# EAGLE schematic MC88110_SmokeTest (EAGLE 9.7.0)
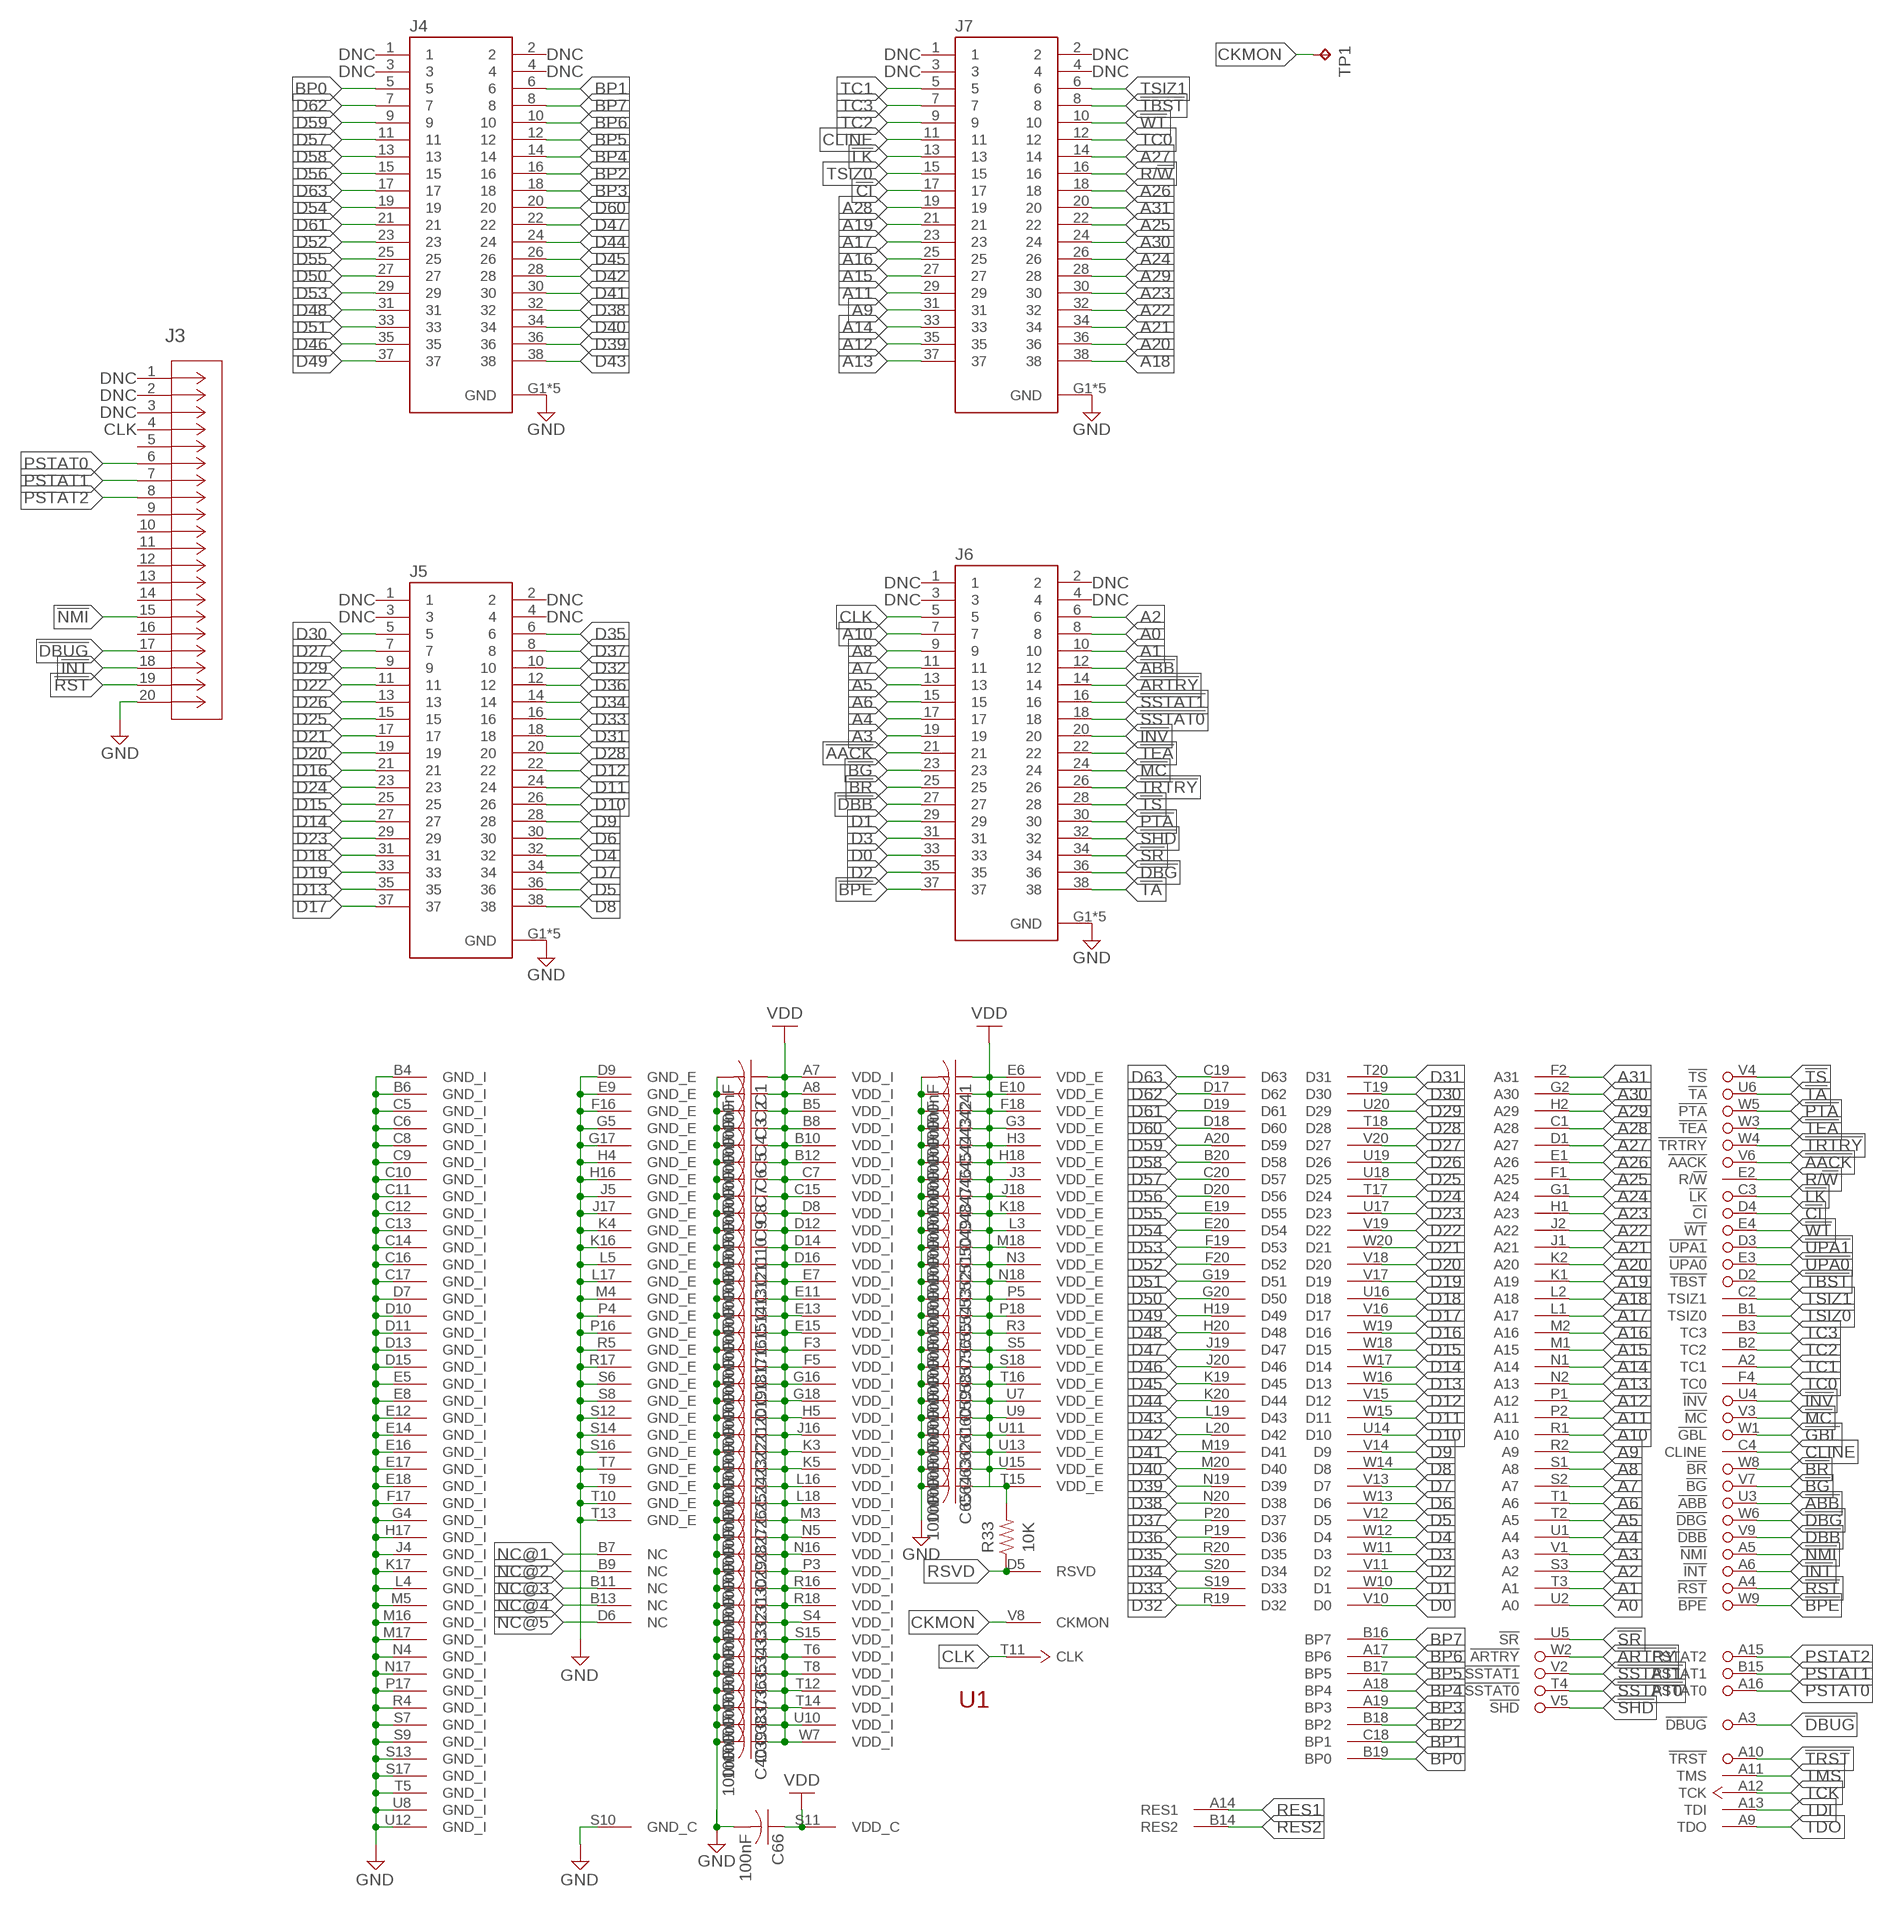
[diagram p0: schematic, sheet 1, part 1 of 2]
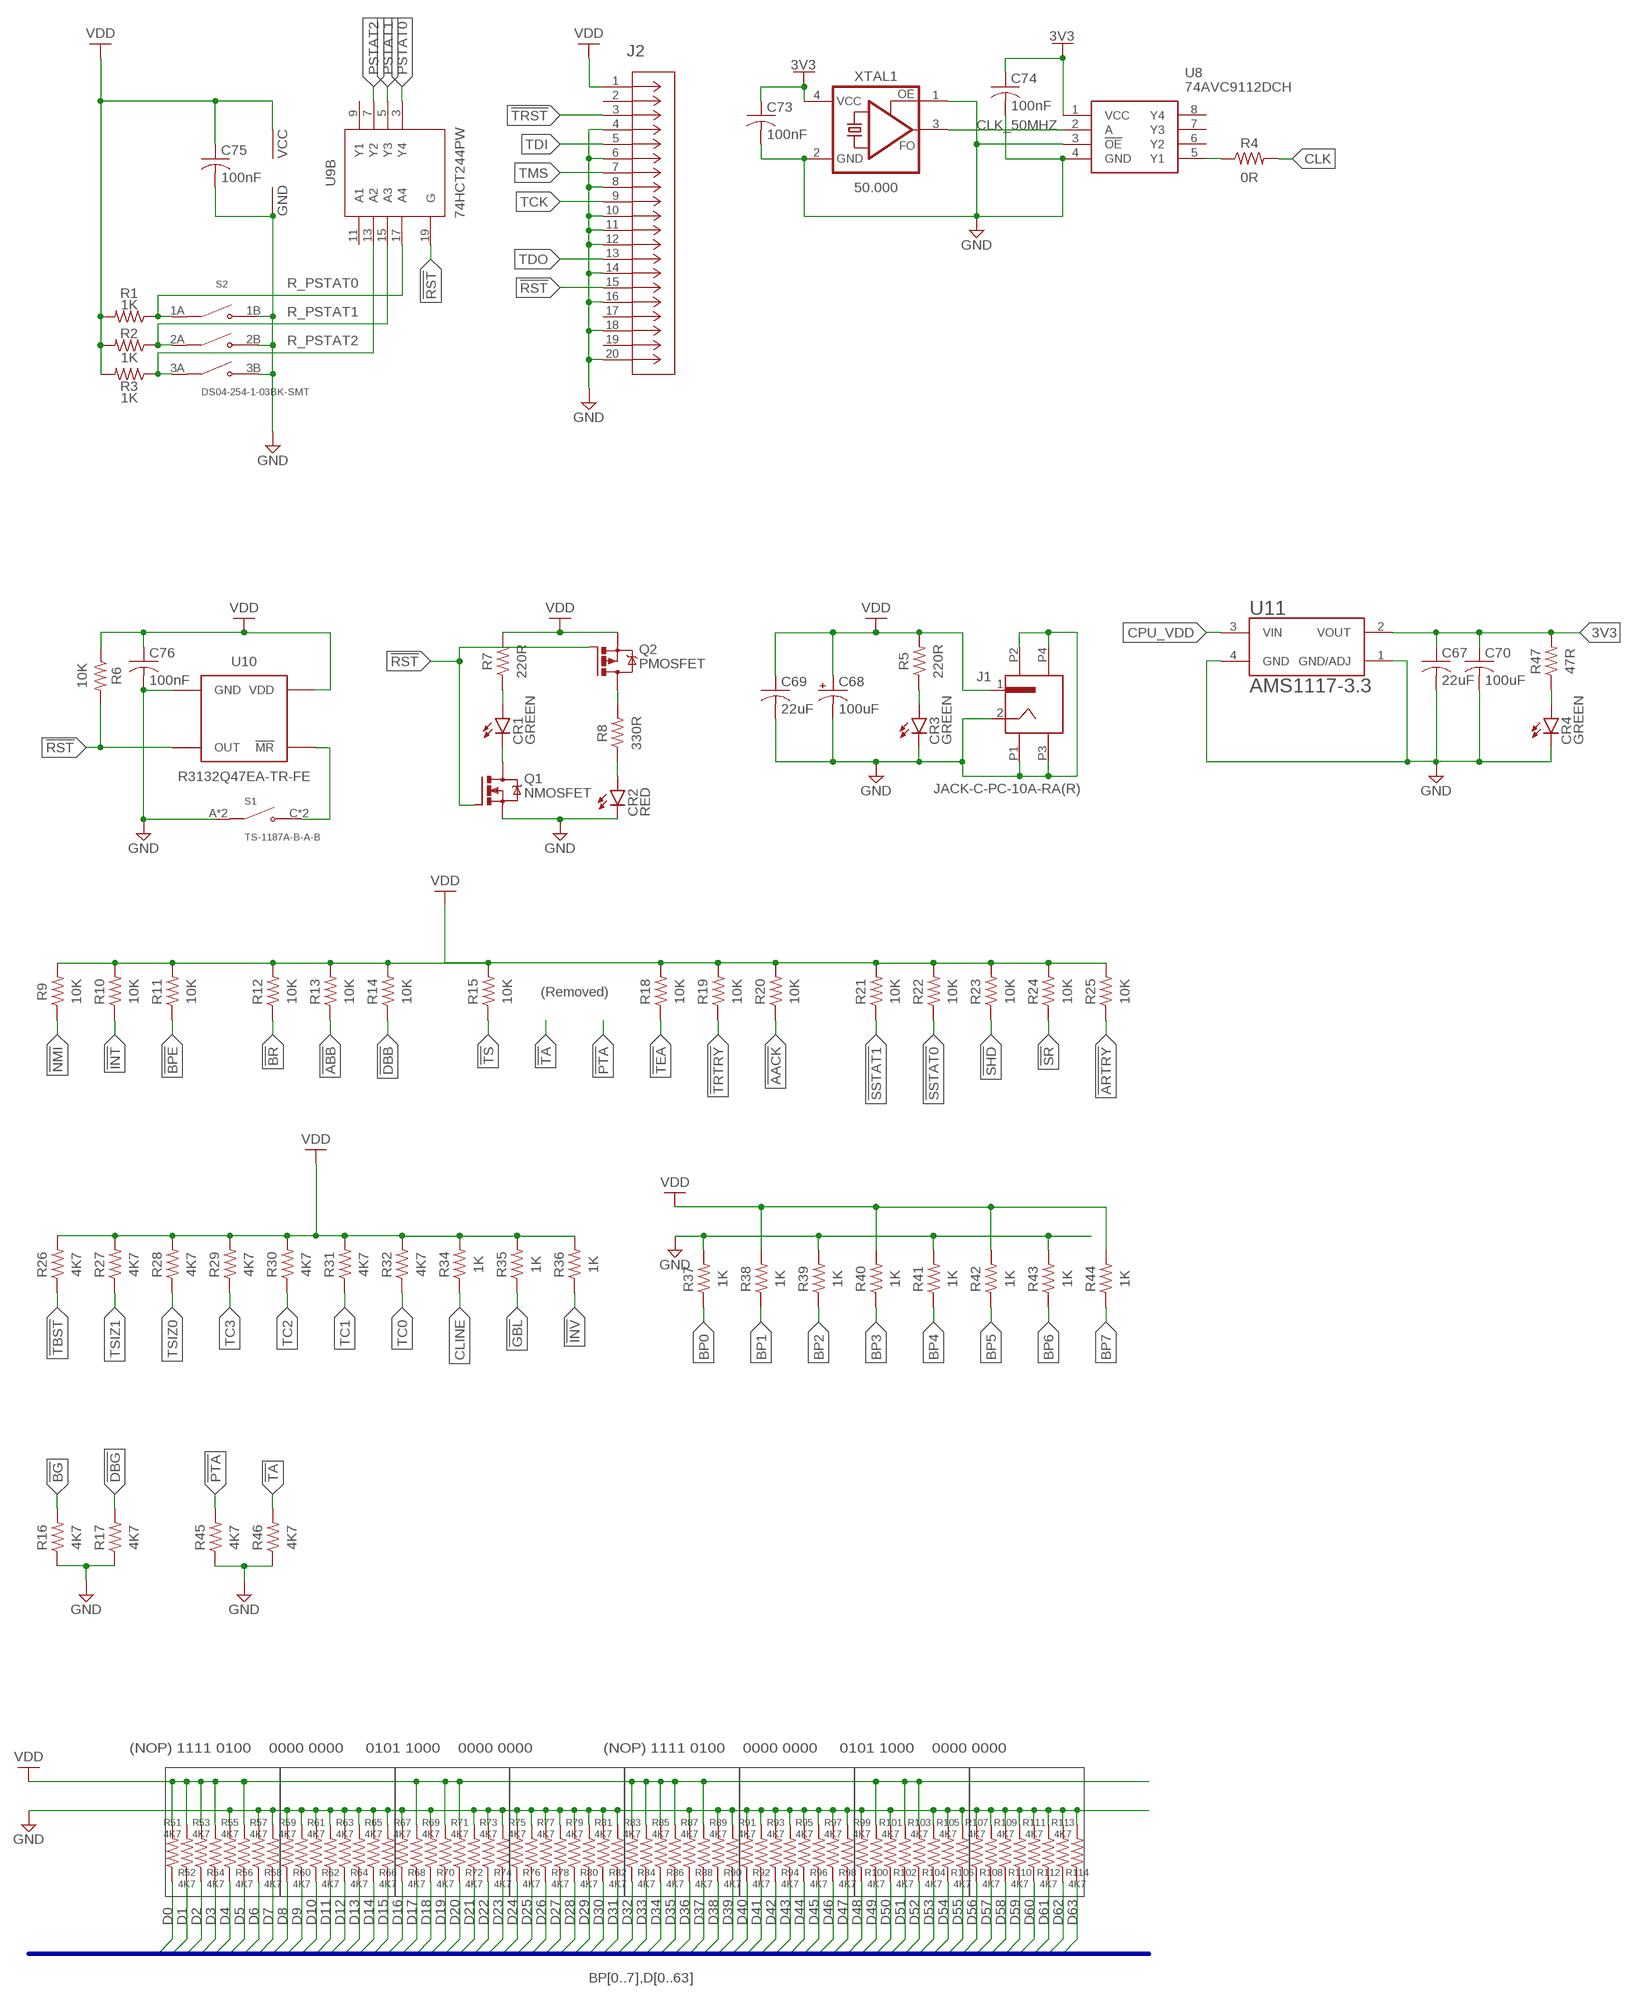
[diagram p1: schematic, sheet 1, part 2 of 2]

## Parts
C1  100nF  C-US_CHIP-0603(1608-METRIC)  [CAPC1608X85]
C2  100nF  C-US_CHIP-0603(1608-METRIC)  [CAPC1608X85]
C3  100nF  C-US_CHIP-0603(1608-METRIC)  [CAPC1608X85]
C4  100nF  C-US_CHIP-0603(1608-METRIC)  [CAPC1608X85]
C5  100nF  C-US_CHIP-0603(1608-METRIC)  [CAPC1608X85]
C6  100nF  C-US_CHIP-0603(1608-METRIC)  [CAPC1608X85]
C7  100nF  C-US_CHIP-0603(1608-METRIC)  [CAPC1608X85]
C8  100nF  C-US_CHIP-0603(1608-METRIC)  [CAPC1608X85]
C9  100nF  C-US_CHIP-0603(1608-METRIC)  [CAPC1608X85]
C10  100nF  C-US_CHIP-0603(1608-METRIC)  [CAPC1608X85]
C11  100nF  C-US_CHIP-0603(1608-METRIC)  [CAPC1608X85]
C12  100nF  C-US_CHIP-0603(1608-METRIC)  [CAPC1608X85]
C13  100nF  C-US_CHIP-0603(1608-METRIC)  [CAPC1608X85]
C14  100nF  C-US_CHIP-0603(1608-METRIC)  [CAPC1608X85]
C15  100nF  C-US_CHIP-0603(1608-METRIC)  [CAPC1608X85]
C16  100nF  C-US_CHIP-0603(1608-METRIC)  [CAPC1608X85]
C17  100nF  C-US_CHIP-0603(1608-METRIC)  [CAPC1608X85]
C18  100nF  C-US_CHIP-0603(1608-METRIC)  [CAPC1608X85]
C19  100nF  C-US_CHIP-0603(1608-METRIC)  [CAPC1608X85]
C20  100nF  C-US_CHIP-0603(1608-METRIC)  [CAPC1608X85]
C21  100nF  C-US_CHIP-0603(1608-METRIC)  [CAPC1608X85]
C22  100nF  C-US_CHIP-0603(1608-METRIC)  [CAPC1608X85]
C23  100nF  C-US_CHIP-0603(1608-METRIC)  [CAPC1608X85]
C24  100nF  C-US_CHIP-0603(1608-METRIC)  [CAPC1608X85]
C25  100nF  C-US_CHIP-0603(1608-METRIC)  [CAPC1608X85]
C26  100nF  C-US_CHIP-0603(1608-METRIC)  [CAPC1608X85]
C27  100nF  C-US_CHIP-0603(1608-METRIC)  [CAPC1608X85]
C28  100nF  C-US_CHIP-0603(1608-METRIC)  [CAPC1608X85]
C29  100nF  C-US_CHIP-0603(1608-METRIC)  [CAPC1608X85]
C30  100nF  C-US_CHIP-0603(1608-METRIC)  [CAPC1608X85]
C31  100nF  C-US_CHIP-0603(1608-METRIC)  [CAPC1608X85]
C32  100nF  C-US_CHIP-0603(1608-METRIC)  [CAPC1608X85]
C33  100nF  C-US_CHIP-0603(1608-METRIC)  [CAPC1608X85]
C34  100nF  C-US_CHIP-0603(1608-METRIC)  [CAPC1608X85]
C35  100nF  C-US_CHIP-0603(1608-METRIC)  [CAPC1608X85]
C36  100nF  C-US_CHIP-0603(1608-METRIC)  [CAPC1608X85]
C37  100nF  C-US_CHIP-0603(1608-METRIC)  [CAPC1608X85]
C38  100nF  C-US_CHIP-0603(1608-METRIC)  [CAPC1608X85]
C39  100nF  C-US_CHIP-0603(1608-METRIC)  [CAPC1608X85]
C40  100nF  C-US_CHIP-0603(1608-METRIC)  [CAPC1608X85]
C41  100nF  C-US_CHIP-0603(1608-METRIC)  [CAPC1608X85]
C42  100nF  C-US_CHIP-0603(1608-METRIC)  [CAPC1608X85]
C43  100nF  C-US_CHIP-0603(1608-METRIC)  [CAPC1608X85]
C44  100nF  C-US_CHIP-0603(1608-METRIC)  [CAPC1608X85]
C45  100nF  C-US_CHIP-0603(1608-METRIC)  [CAPC1608X85]
C46  100nF  C-US_CHIP-0603(1608-METRIC)  [CAPC1608X85]
C47  100nF  C-US_CHIP-0603(1608-METRIC)  [CAPC1608X85]
C48  100nF  C-US_CHIP-0603(1608-METRIC)  [CAPC1608X85]
C49  100nF  C-US_CHIP-0603(1608-METRIC)  [CAPC1608X85]
C50  100nF  C-US_CHIP-0603(1608-METRIC)  [CAPC1608X85]
C51  100nF  C-US_CHIP-0603(1608-METRIC)  [CAPC1608X85]
C52  100nF  C-US_CHIP-0603(1608-METRIC)  [CAPC1608X85]
C53  100nF  C-US_CHIP-0603(1608-METRIC)  [CAPC1608X85]
C54  100nF  C-US_CHIP-0603(1608-METRIC)  [CAPC1608X85]
C55  100nF  C-US_CHIP-0603(1608-METRIC)  [CAPC1608X85]
C56  100nF  C-US_CHIP-0603(1608-METRIC)  [CAPC1608X85]
C57  100nF  C-US_CHIP-0603(1608-METRIC)  [CAPC1608X85]
C58  100nF  C-US_CHIP-0603(1608-METRIC)  [CAPC1608X85]
C59  100nF  C-US_CHIP-0603(1608-METRIC)  [CAPC1608X85]
C60  100nF  C-US_CHIP-0603(1608-METRIC)  [CAPC1608X85]
C61  100nF  C-US_CHIP-0603(1608-METRIC)  [CAPC1608X85]
C62  100nF  C-US_CHIP-0603(1608-METRIC)  [CAPC1608X85]
C63  100nF  C-US_CHIP-0603(1608-METRIC)  [CAPC1608X85]
C64  100nF  C-US_CHIP-0603(1608-METRIC)  [CAPC1608X85]
C65  100nF  C-US_CHIP-0603(1608-METRIC)  [CAPC1608X85]
C66  100nF  C-US_CHIP-0603(1608-METRIC)  [CAPC1608X85]
C67  22uF  C-US_CHIP-0603(1608-METRIC)  [CAPC1608X85]
C68  100uF  C-POL-US_TANTALUM-2917(7343-METRIC)  [CAPMP7343X310N]
C69  22uF  C-US_CHIP-0603(1608-METRIC)  [CAPC1608X85]
C70  100uF  C-US_CHIP-0603(1608-METRIC)  [CAPC1608X85]
C73  100nF  C-US_CHIP-0603(1608-METRIC)  [CAPC1608X85]
C74  100nF  C-US_CHIP-0603(1608-METRIC)  [CAPC1608X85]
C75  100nF  C-US_CHIP-0603(1608-METRIC)  [CAPC1608X85]
C76  100nF  C-US_CHIP-0603(1608-METRIC)  [CAPC1608X85]
CR1  GREEN  LEDSML0603  [SML0603]
CR2  RED  LEDSML0603  [SML0603]
CR3  GREEN  LEDSML0603  [SML0603]
CR4  GREEN  LEDSML0603  [SML0603]
J1  JACK-C-PC-10A-RA(R)  [GLOBTECK_JACK-C-PC-10A-RA(R)]
J2  30320-6002HBCONN_30320-6002HB_3MM  [CONN_30320-6002HB_3MM]
J3  30320-6002HBCONN_30320-6002HB_3MM  [CONN_30320-6002HB_3MM]
J4  2-767004-2  [TE_2-767004-2]
J5  2-767004-2  [TE_2-767004-2]
J6  2-767004-2  [TE_2-767004-2]
J7  2-767004-2  [TE_2-767004-2]
Q1  NMOSFET  NMOSFETSOT23-GSD  [SOT23]
Q2  PMOSFET  PMOSFET_SOT23-GSD  [SOT23]
R1  1K  R-US_CHIP-0603(1608-METRIC)  [RESC1608X60]
R2  1K  R-US_CHIP-0603(1608-METRIC)  [RESC1608X60]
R3  1K  R-US_CHIP-0603(1608-METRIC)  [RESC1608X60]
R4  0R  R-US_CHIP-0603(1608-METRIC)  [RESC1608X60]
R5  220R  R-US_CHIP-0603(1608-METRIC)  [RESC1608X60]
R6  10K  R-US_CHIP-0603(1608-METRIC)  [RESC1608X60]
R7  220R  R-US_CHIP-0603(1608-METRIC)  [RESC1608X60]
R8  330R  R-US_CHIP-0603(1608-METRIC)  [RESC1608X60]
R9  10K  R-US_CHIP-0603(1608-METRIC)  [RESC1608X60]
R10  10K  R-US_CHIP-0603(1608-METRIC)  [RESC1608X60]
R11  10K  R-US_CHIP-0603(1608-METRIC)  [RESC1608X60]
R12  10K  R-US_CHIP-0603(1608-METRIC)  [RESC1608X60]
R13  10K  R-US_CHIP-0603(1608-METRIC)  [RESC1608X60]
R14  10K  R-US_CHIP-0603(1608-METRIC)  [RESC1608X60]
R15  10K  R-US_CHIP-0603(1608-METRIC)  [RESC1608X60]
R16  4K7  R-US_CHIP-0603(1608-METRIC)  [RESC1608X60]
R17  4K7  R-US_CHIP-0603(1608-METRIC)  [RESC1608X60]
R18  10K  R-US_CHIP-0603(1608-METRIC)  [RESC1608X60]
R19  10K  R-US_CHIP-0603(1608-METRIC)  [RESC1608X60]
R20  10K  R-US_CHIP-0603(1608-METRIC)  [RESC1608X60]
R21  10K  R-US_CHIP-0603(1608-METRIC)  [RESC1608X60]
R22  10K  R-US_CHIP-0603(1608-METRIC)  [RESC1608X60]
R23  10K  R-US_CHIP-0603(1608-METRIC)  [RESC1608X60]
R24  10K  R-US_CHIP-0603(1608-METRIC)  [RESC1608X60]
R25  10K  R-US_CHIP-0603(1608-METRIC)  [RESC1608X60]
R26  4K7  R-US_CHIP-0603(1608-METRIC)  [RESC1608X60]
R27  4K7  R-US_CHIP-0603(1608-METRIC)  [RESC1608X60]
R28  4K7  R-US_CHIP-0603(1608-METRIC)  [RESC1608X60]
R29  4K7  R-US_CHIP-0603(1608-METRIC)  [RESC1608X60]
R30  4K7  R-US_CHIP-0603(1608-METRIC)  [RESC1608X60]
R31  4K7  R-US_CHIP-0603(1608-METRIC)  [RESC1608X60]
R32  4K7  R-US_CHIP-0603(1608-METRIC)  [RESC1608X60]
R33  10K  R-US_CHIP-0603(1608-METRIC)  [RESC1608X60]
R34  1K  R-US_CHIP-0603(1608-METRIC)  [RESC1608X60]
R35  1K  R-US_CHIP-0603(1608-METRIC)  [RESC1608X60]
R36  1K  R-US_CHIP-0603(1608-METRIC)  [RESC1608X60]
R37  1K  R-US_CHIP-0603(1608-METRIC)  [RESC1608X60]
R38  1K  R-US_CHIP-0603(1608-METRIC)  [RESC1608X60]
R39  1K  R-US_CHIP-0603(1608-METRIC)  [RESC1608X60]
R40  1K  R-US_CHIP-0603(1608-METRIC)  [RESC1608X60]
R41  1K  R-US_CHIP-0603(1608-METRIC)  [RESC1608X60]
R42  1K  R-US_CHIP-0603(1608-METRIC)  [RESC1608X60]
R43  1K  R-US_CHIP-0603(1608-METRIC)  [RESC1608X60]
R44  1K  R-US_CHIP-0603(1608-METRIC)  [RESC1608X60]
R45  4K7  R-US_CHIP-0603(1608-METRIC)  [RESC1608X60]
R46  4K7  R-US_CHIP-0603(1608-METRIC)  [RESC1608X60]
R47  47R  R-US_CHIP-0603(1608-METRIC)  [RESC1608X60]
R51  4K7  R-US_CHIP-0603(1608-METRIC)  [RESC1608X60]
R52  4K7  R-US_CHIP-0603(1608-METRIC)  [RESC1608X60]
R53  4K7  R-US_CHIP-0603(1608-METRIC)  [RESC1608X60]
R54  4K7  R-US_CHIP-0603(1608-METRIC)  [RESC1608X60]
R55  4K7  R-US_CHIP-0603(1608-METRIC)  [RESC1608X60]
R56  4K7  R-US_CHIP-0603(1608-METRIC)  [RESC1608X60]
R57  4K7  R-US_CHIP-0603(1608-METRIC)  [RESC1608X60]
R58  4K7  R-US_CHIP-0603(1608-METRIC)  [RESC1608X60]
R59  4K7  R-US_CHIP-0603(1608-METRIC)  [RESC1608X60]
R60  4K7  R-US_CHIP-0603(1608-METRIC)  [RESC1608X60]
R61  4K7  R-US_CHIP-0603(1608-METRIC)  [RESC1608X60]
R62  4K7  R-US_CHIP-0603(1608-METRIC)  [RESC1608X60]
R63  4K7  R-US_CHIP-0603(1608-METRIC)  [RESC1608X60]
R64  4K7  R-US_CHIP-0603(1608-METRIC)  [RESC1608X60]
R65  4K7  R-US_CHIP-0603(1608-METRIC)  [RESC1608X60]
R66  4K7  R-US_CHIP-0603(1608-METRIC)  [RESC1608X60]
R67  4K7  R-US_CHIP-0603(1608-METRIC)  [RESC1608X60]
R68  4K7  R-US_CHIP-0603(1608-METRIC)  [RESC1608X60]
R69  4K7  R-US_CHIP-0603(1608-METRIC)  [RESC1608X60]
R70  4K7  R-US_CHIP-0603(1608-METRIC)  [RESC1608X60]
R71  4K7  R-US_CHIP-0603(1608-METRIC)  [RESC1608X60]
R72  4K7  R-US_CHIP-0603(1608-METRIC)  [RESC1608X60]
R73  4K7  R-US_CHIP-0603(1608-METRIC)  [RESC1608X60]
R74  4K7  R-US_CHIP-0603(1608-METRIC)  [RESC1608X60]
R75  4K7  R-US_CHIP-0603(1608-METRIC)  [RESC1608X60]
R76  4K7  R-US_CHIP-0603(1608-METRIC)  [RESC1608X60]
R77  4K7  R-US_CHIP-0603(1608-METRIC)  [RESC1608X60]
R78  4K7  R-US_CHIP-0603(1608-METRIC)  [RESC1608X60]
R79  4K7  R-US_CHIP-0603(1608-METRIC)  [RESC1608X60]
R80  4K7  R-US_CHIP-0603(1608-METRIC)  [RESC1608X60]
R81  4K7  R-US_CHIP-0603(1608-METRIC)  [RESC1608X60]
R82  4K7  R-US_CHIP-0603(1608-METRIC)  [RESC1608X60]
R83  4K7  R-US_CHIP-0603(1608-METRIC)  [RESC1608X60]
R84  4K7  R-US_CHIP-0603(1608-METRIC)  [RESC1608X60]
R85  4K7  R-US_CHIP-0603(1608-METRIC)  [RESC1608X60]
R86  4K7  R-US_CHIP-0603(1608-METRIC)  [RESC1608X60]
R87  4K7  R-US_CHIP-0603(1608-METRIC)  [RESC1608X60]
R88  4K7  R-US_CHIP-0603(1608-METRIC)  [RESC1608X60]
R89  4K7  R-US_CHIP-0603(1608-METRIC)  [RESC1608X60]
R90  4K7  R-US_CHIP-0603(1608-METRIC)  [RESC1608X60]
R91  4K7  R-US_CHIP-0603(1608-METRIC)  [RESC1608X60]
R92  4K7  R-US_CHIP-0603(1608-METRIC)  [RESC1608X60]
R93  4K7  R-US_CHIP-0603(1608-METRIC)  [RESC1608X60]
R94  4K7  R-US_CHIP-0603(1608-METRIC)  [RESC1608X60]
R95  4K7  R-US_CHIP-0603(1608-METRIC)  [RESC1608X60]
R96  4K7  R-US_CHIP-0603(1608-METRIC)  [RESC1608X60]
R97  4K7  R-US_CHIP-0603(1608-METRIC)  [RESC1608X60]
R98  4K7  R-US_CHIP-0603(1608-METRIC)  [RESC1608X60]
R99  4K7  R-US_CHIP-0603(1608-METRIC)  [RESC1608X60]
R100  4K7  R-US_CHIP-0603(1608-METRIC)  [RESC1608X60]
R101  4K7  R-US_CHIP-0603(1608-METRIC)  [RESC1608X60]
R102  4K7  R-US_CHIP-0603(1608-METRIC)  [RESC1608X60]
R103  4K7  R-US_CHIP-0603(1608-METRIC)  [RESC1608X60]
R104  4K7  R-US_CHIP-0603(1608-METRIC)  [RESC1608X60]
R105  4K7  R-US_CHIP-0603(1608-METRIC)  [RESC1608X60]
R106  4K7  R-US_CHIP-0603(1608-METRIC)  [RESC1608X60]
R107  4K7  R-US_CHIP-0603(1608-METRIC)  [RESC1608X60]
R108  4K7  R-US_CHIP-0603(1608-METRIC)  [RESC1608X60]
R109  4K7  R-US_CHIP-0603(1608-METRIC)  [RESC1608X60]
R110  4K7  R-US_CHIP-0603(1608-METRIC)  [RESC1608X60]
R111  4K7  R-US_CHIP-0603(1608-METRIC)  [RESC1608X60]
R112  4K7  R-US_CHIP-0603(1608-METRIC)  [RESC1608X60]
R113  4K7  R-US_CHIP-0603(1608-METRIC)  [RESC1608X60]
R114  4K7  R-US_CHIP-0603(1608-METRIC)  [RESC1608X60]
S1  TS-1187A-B-A-B  [SW_TS-1187A-B-A-B]
S2  DS04-254-1-03BK-SMT  [SW_DS04-254-1-03BK-SMT]
TP1  TPTP10R  [TP10R]
U1  MC88110RC50H  [PGA299]
U8  74AVC9112DCH  [SOP50P310X100-8N]
U9  74HCT244PW  74HCT244S  [PW20]
U10  R3132Q47EA-TR-FE  R3132Q  [R3132Q]
U11  AMS1117-3.3  [SOT229P700X180-4N]
XTAL1  50.000  OSC_3.2X2.5X0.9  [OSCCC320X250X90]

## Nets
3V3 [Supply]: C67.1 C70.1 C73.1 C74.1 R47.2 U8.1(VCC) U11.2(VOUT) XTAL1.4(VCC)
!AACK [Signal]: J6.21 R20.1 U1.V6(!AACK)
!ABB [Signal]: J6.12 R13.1 U1.U3(!ABB)
!ARTRY [Signal]: J6.14 R25.1 U1.W2(!ARTRY)
!BG [Signal]: J6.23 R16.2 U1.V7(!BG)
!BPE [Signal]: J6.37 R11.1 U1.W9(!BPE)
!BR [Signal]: J6.25 R12.1 U1.W8(!BR)
!CI [Signal]: J7.17 U1.D4(!CI)
!DBB [Signal]: J6.27 R14.1 U1.V9(!DBB)
!DBG [Signal]: J6.36 R17.2 U1.W6(!DBG)
!DBUG [Signal]: J3.17 U1.A3(!DBUG)
!GBL [Signal]: R35.1 U1.W1(!GBL)
!INT [Signal]: J3.18 R10.1 U1.A6(!INT)
!INV [Signal]: J6.20 R36.1 U1.U4(!INV)
!LK [Signal]: J7.13 U1.C3(!LK)
!MC [Signal]: J6.24 U1.V3(!MC)
!MR [Signal]: S1.C(NO) S1.D(NO) U10.P$3(!MR)
!NMI [Signal]: J3.15 R9.1 U1.A5(!NMI)
!PTA [Signal]: J6.30 R45.2 U1.W5(!PTA)
!RST [Signal]: J2.15 J3.19 Q1.1(G) Q2.1(G) R6.2 U1.A4(!RST) U9.19(B:G) U10.P$2(OUT)
!SHD [Signal]: J6.32 R23.1 U1.V5(!SHD)
!SR [Signal]: J6.34 R24.1 U1.U5(!SR)
!SSTAT0 [Signal]: J6.18 R22.1 U1.T4(!SSTAT0)
!SSTAT1 [Signal]: J6.16 R21.1 U1.V2(!SSTAT1)
!TA [Signal]: J6.38 R46.2 U1.U6(!TA)
!TBST [Signal]: J7.8 R26.1 U1.D2(!TBST)
!TEA [Signal]: J6.22 R18.1 U1.W3(!TEA)
!TRST [Signal]: J2.3 U1.A10(!TRST)
!TRTRY [Signal]: J6.26 R19.1 U1.W4(!TRTRY)
!TS [Signal]: J6.28 R15.1 U1.V4(!TS)
!UPA0 [Signal]: U1.E3(!UPA0)
!UPA1 [Signal]: U1.D3(!UPA1)
!WT [Signal]: J7.10 U1.E4(!WT)
A0 [Signal]: J6.8 U1.U2(A0)
A1 [Signal]: J6.10 U1.T3(A1)
A2 [Signal]: J6.6 U1.S3(A2)
A3 [Signal]: J6.19 U1.V1(A3)
A4 [Signal]: J6.17 U1.U1(A4)
A5 [Signal]: J6.13 U1.T2(A5)
A6 [Signal]: J6.15 U1.T1(A6)
A7 [Signal]: J6.11 U1.S2(A7)
A8 [Signal]: J6.9 U1.S1(A8)
A9 [Signal]: J7.31 U1.R2(A9)
A10 [Signal]: J6.7 U1.R1(A10)
A11 [Signal]: J7.29 U1.P2(A11)
A12 [Signal]: J7.35 U1.P1(A12)
A13 [Signal]: J7.37 U1.N2(A13)
A14 [Signal]: J7.33 U1.N1(A14)
A15 [Signal]: J7.27 U1.M1(A15)
A16 [Signal]: J7.25 U1.M2(A16)
A17 [Signal]: J7.23 U1.L1(A17)
A18 [Signal]: J7.38 U1.L2(A18)
A19 [Signal]: J7.21 U1.K1(A19)
A20 [Signal]: J7.36 U1.K2(A20)
A21 [Signal]: J7.34 U1.J1(A21)
A22 [Signal]: J7.32 U1.J2(A22)
A23 [Signal]: J7.30 U1.H1(A23)
A24 [Signal]: J7.26 U1.G1(A24)
A25 [Signal]: J7.22 U1.F1(A25)
A26 [Signal]: J7.18 U1.E1(A26)
A27 [Signal]: J7.14 U1.D1(A27)
A28 [Signal]: J7.19 U1.C1(A28)
A29 [Signal]: J7.28 U1.H2(A29)
A30 [Signal]: J7.24 U1.G2(A30)
A31 [Signal]: J7.20 U1.F2(A31)
BP0 [Signal]: J4.5 R37.1 U1.B19(BP0)
BP1 [Signal]: J4.6 R38.1 U1.C18(BP1)
BP2 [Signal]: J4.16 R39.1 U1.B18(BP2)
BP3 [Signal]: J4.18 R40.1 U1.A19(BP3)
BP4 [Signal]: J4.14 R41.1 U1.A18(BP4)
BP5 [Signal]: J4.12 R42.1 U1.B17(BP5)
BP6 [Signal]: J4.10 R43.1 U1.A17(BP6)
BP7 [Signal]: J4.8 R44.1 U1.B16(BP7)
CKMON [Signal]: TP1.TP U1.V8(CKMON)
CLINE [Signal]: J7.11 R34.1 U1.C4(CLINE)
CLK [Signal]: J6.5 R4.2 U1.T11(CLK)
CLK_50MHZ [Signal]: U8.2(A) XTAL1.3(FO)
CPU_VDD [Supply]: C1.1 C2.1 C3.1 C4.1 C5.1 C6.1 C7.1 C8.1 C9.1 C10.1 C11.1 C12.1 C13.1 C14.1 C15.1 C16.1 C17.1 C18.1 C19.1 C20.1 C21.1 C22.1 C23.1 C24.1 C25.1 C26.1 C27.1 C28.1 C29.1 C30.1 C31.1 C32.1 C33.1 C34.1 C35.1 C36.1 C37.1 C38.1 C39.1 C40.1 C41.1 C42.1 C43.1 C44.1 C45.1 C46.1 C47.1 C48.1 C49.1 C50.1 C51.1 C52.1 C53.1 C54.1 C55.1 C56.1 C57.1 C58.1 C59.1 C60.1 C61.1 C62.1 C63.1 C64.1 C65.1 C66.1 C68.1(+) C69.1 C75.1 C76.1 J1.1 J2.1 Q2.2(S) R1.2 R2.2 R3.2 R5.2 R6.1 R7.2 R9.2 R10.2 R11.2 R12.2 R13.2 R14.2 R15.2 R18.2 R19.2 R20.2 R21.2 R22.2 R23.2 R24.2 R25.2 R26.2 R27.2 R28.2 R29.2 R30.2 R31.2 R32.2 R33.2 R34.2 R35.2 R36.2 R38.2 R40.2 R42.2 R44.2 R51.2 R52.2 R53.2 R54.2 R56.2 R68.2 R70.2 R71.2 R83.2 R84.2 R85.2 R86.2 R88.2 R100.2 R102.2 R103.2 U1.A7(VDD_I) U1.A8(VDD_I) U1.B5(VDD_I) U1.B8(VDD_I) U1.B10(VDD_I) U1.B12(VDD_I) U1.C7(VDD_I) U1.C15(VDD_I) U1.D8(VDD_I) U1.D12(VDD_I) U1.D14(VDD_I) U1.D16(VDD_I) U1.E6(VDD_E) U1.E7(VDD_I) U1.E10(VDD_E) U1.E11(VDD_I) U1.E13(VDD_I) U1.E15(VDD_I) U1.F3(VDD_I) U1.F5(VDD_I) U1.F18(VDD_E) U1.G3(VDD_E) U1.G16(VDD_I) U1.G18(VDD_I) U1.H3(VDD_E) U1.H5(VDD_I) U1.H18(VDD_E) U1.J3(VDD_E) U1.J16(VDD_I) U1.J18(VDD_E) U1.K3(VDD_I) U1.K5(VDD_I) U1.K18(VDD_E) U1.L3(VDD_E) U1.L16(VDD_I) U1.L18(VDD_I) U1.M3(VDD_I) U1.M18(VDD_E) U1.N3(VDD_E) U1.N5(VDD_I) U1.N16(VDD_I) U1.N18(VDD_E) U1.P3(VDD_I) U1.P5(VDD_E) U1.P18(VDD_E) U1.R3(VDD_E) U1.R16(VDD_I) U1.R18(VDD_I) U1.S4(VDD_I) U1.S5(VDD_E) U1.S11(VDD_C) U1.S15(VDD_I) U1.S18(VDD_E) U1.T6(VDD_I) U1.T8(VDD_I) U1.T12(VDD_I) U1.T14(VDD_I) U1.T15(VDD_E) U1.T16(VDD_E) U1.U7(VDD_E) U1.U9(VDD_E) U1.U10(VDD_I) U1.U11(VDD_E) U1.U13(VDD_E) U1.U15(VDD_E) U1.W7(VDD_I) U9.20(VCC) U10.P$4(VDD) U11.3(VIN) ; supply symbol labelled VDD
D0 [Signal]: J6.33 R51.1 U1.V10(D0)
D1 [Signal]: J6.29 R52.1 U1.W10(D1)
D2 [Signal]: J6.35 R53.1 U1.V11(D2)
D3 [Signal]: J6.31 R54.1 U1.W11(D3)
D4 [Signal]: J5.32 R55.1 U1.W12(D4)
D5 [Signal]: J5.36 R56.1 U1.V12(D5)
D6 [Signal]: J5.30 R57.1 U1.W13(D6)
D7 [Signal]: J5.34 R58.1 U1.V13(D7)
D8 [Signal]: J5.38 R59.1 U1.W14(D8)
D9 [Signal]: J5.28 R60.1 U1.V14(D9)
D10 [Signal]: J5.26 R61.1 U1.U14(D10)
D11 [Signal]: J5.24 R62.1 U1.W15(D11)
D12 [Signal]: J5.22 R63.1 U1.V15(D12)
D13 [Signal]: J5.35 R64.1 U1.W16(D13)
D14 [Signal]: J5.27 R65.1 U1.W17(D14)
D15 [Signal]: J5.25 R66.1 U1.W18(D15)
D16 [Signal]: J5.21 R67.1 U1.W19(D16)
D17 [Signal]: J5.37 R68.1 U1.V16(D17)
D18 [Signal]: J5.31 R69.1 U1.U16(D18)
D19 [Signal]: J5.33 R70.1 U1.V17(D19)
D20 [Signal]: J5.19 R71.1 U1.V18(D20)
D21 [Signal]: J5.17 R72.1 U1.W20(D21)
D22 [Signal]: J5.11 R73.1 U1.V19(D22)
D23 [Signal]: J5.29 R74.1 U1.U17(D23)
D24 [Signal]: J5.23 R75.1 U1.T17(D24)
D25 [Signal]: J5.15 R76.1 U1.U18(D25)
D26 [Signal]: J5.13 R77.1 U1.U19(D26)
D27 [Signal]: J5.7 R78.1 U1.V20(D27)
D28 [Signal]: J5.20 R79.1 U1.T18(D28)
D29 [Signal]: J5.9 R80.1 U1.U20(D29)
D30 [Signal]: J5.5 R81.1 U1.T19(D30)
D31 [Signal]: J5.18 R82.1 U1.T20(D31)
D32 [Signal]: J5.10 R83.1 U1.R19(D32)
D33 [Signal]: J5.16 R84.1 U1.S19(D33)
D34 [Signal]: J5.14 R85.1 U1.S20(D34)
D35 [Signal]: J5.6 R86.1 U1.R20(D35)
D36 [Signal]: J5.12 R87.1 U1.P19(D36)
D37 [Signal]: J5.8 R88.1 U1.P20(D37)
D38 [Signal]: J4.32 R89.1 U1.N20(D38)
D39 [Signal]: J4.36 R90.1 U1.N19(D39)
D40 [Signal]: J4.34 R91.1 U1.M20(D40)
D41 [Signal]: J4.30 R92.1 U1.M19(D41)
D42 [Signal]: J4.28 R93.1 U1.L20(D42)
D43 [Signal]: J4.38 R94.1 U1.L19(D43)
D44 [Signal]: J4.24 R95.1 U1.K20(D44)
D45 [Signal]: J4.26 R96.1 U1.K19(D45)
D46 [Signal]: J4.35 R97.1 U1.J20(D46)
D47 [Signal]: J4.22 R98.1 U1.J19(D47)
D48 [Signal]: J4.31 R99.1 U1.H20(D48)
D49 [Signal]: J4.37 R100.1 U1.H19(D49)
D50 [Signal]: J4.27 R101.1 U1.G20(D50)
D51 [Signal]: J4.33 R102.1 U1.G19(D51)
D52 [Signal]: J4.23 R103.1 U1.F20(D52)
D53 [Signal]: J4.29 R104.1 U1.F19(D53)
D54 [Signal]: J4.19 R105.1 U1.E20(D54)
D55 [Signal]: J4.25 R106.1 U1.E19(D55)
D56 [Signal]: J4.15 R107.1 U1.D20(D56)
D57 [Signal]: J4.11 R108.1 U1.C20(D57)
D58 [Signal]: J4.13 R109.1 U1.B20(D58)
D59 [Signal]: J4.9 R110.1 U1.A20(D59)
D60 [Signal]: J4.20 R111.1 U1.D18(D60)
D61 [Signal]: J4.21 R112.1 U1.D19(D61)
D62 [Signal]: J4.7 R113.1 U1.D17(D62)
D63 [Signal]: J4.17 R114.1 U1.C19(D63)
GND [Supply]: C1.2 C2.2 C3.2 C4.2 C5.2 C6.2 C7.2 C8.2 C9.2 C10.2 C11.2 C12.2 C13.2 C14.2 C15.2 C16.2 C17.2 C18.2 C19.2 C20.2 C21.2 C22.2 C23.2 C24.2 C25.2 C26.2 C27.2 C28.2 C29.2 C30.2 C31.2 C32.2 C33.2 C34.2 C35.2 C36.2 C37.2 C38.2 C39.2 C40.2 C41.2 C42.2 C43.2 C44.2 C45.2 C46.2 C47.2 C48.2 C49.2 C50.2 C51.2 C52.2 C53.2 C54.2 C55.2 C56.2 C57.2 C58.2 C59.2 C60.2 C61.2 C62.2 C63.2 C64.2 C65.2 C66.2 C67.2 C68.2(-) C69.2 C70.2 C73.2 C74.2 C75.2 C76.2 CR2.C CR3.C CR4.C J1.2 J1.P1 J1.P2 J1.P3 J1.P4 J2.4 J2.6 J2.8 J2.10 J2.11 J2.12 J2.14 J2.16 J2.18 J2.20 J3.20 J4.G1(GND) J4.G2(GND) J4.G3(GND) J4.G4(GND) J4.G5(GND) J5.G1(GND) J5.G2(GND) J5.G3(GND) J5.G4(GND) J5.G5(GND) J6.G1(GND) J6.G2(GND) J6.G3(GND) J6.G4(GND) J6.G5(GND) J7.G1(GND) J7.G2(GND) J7.G3(GND) J7.G4(GND) J7.G5(GND) Q1.2(S) R16.1 R17.1 R37.2 R39.2 R41.2 R43.2 R45.1 R46.1 R55.2 R57.2 R58.2 R59.2 R60.2 R61.2 R62.2 R63.2 R64.2 R65.2 R66.2 R67.2 R69.2 R72.2 R73.2 R74.2 R75.2 R76.2 R77.2 R78.2 R79.2 R80.2 R81.2 R82.2 R87.2 R89.2 R90.2 R91.2 R92.2 R93.2 R94.2 R95.2 R96.2 R97.2 R98.2 R99.2 R101.2 R104.2 R105.2 R106.2 R107.2 R108.2 R109.2 R110.2 R111.2 R112.2 R113.2 R114.2 S1.A(COM) S1.B(COM) S2.1B(NO1) S2.2B(NO2) S2.3B(NO3) U1.B4(GND_I) U1.B6(GND_I) U1.C5(GND_I) U1.C6(GND_I) U1.C8(GND_I) U1.C9(GND_I) U1.C10(GND_I) U1.C11(GND_I) U1.C12(GND_I) U1.C13(GND_I) U1.C14(GND_I) U1.C16(GND_I) U1.C17(GND_I) U1.D7(GND_I) U1.D9(GND_E) U1.D10(GND_I) U1.D11(GND_I) U1.D13(GND_I) U1.D15(GND_I) U1.E5(GND_I) U1.E8(GND_I) U1.E9(GND_E) U1.E12(GND_I) U1.E14(GND_I) U1.E16(GND_I) U1.E17(GND_I) U1.E18(GND_I) U1.F16(GND_E) U1.F17(GND_I) U1.G4(GND_I) U1.G5(GND_E) U1.G17(GND_E) U1.H4(GND_E) U1.H16(GND_E) U1.H17(GND_I) U1.J4(GND_I) U1.J5(GND_E) U1.J17(GND_E) U1.K4(GND_E) U1.K16(GND_E) U1.K17(GND_I) U1.L4(GND_I) U1.L5(GND_E) U1.L17(GND_E) U1.M4(GND_E) U1.M5(GND_I) U1.M16(GND_I) U1.M17(GND_I) U1.N4(GND_I) U1.N17(GND_I) U1.P4(GND_E) U1.P16(GND_E) U1.P17(GND_I) U1.R4(GND_I) U1.R5(GND_E) U1.R17(GND_E) U1.S6(GND_E) U1.S7(GND_I) U1.S8(GND_E) U1.S9(GND_I) U1.S10(GND_C) U1.S12(GND_E) U1.S13(GND_I) U1.S14(GND_E) U1.S16(GND_E) U1.S17(GND_I) U1.T5(GND_I) U1.T7(GND_E) U1.T9(GND_E) U1.T10(GND_E) U1.T13(GND_E) U1.U8(GND_I) U1.U12(GND_I) U8.3(!OE) U8.4(GND) U9.10(GND) U10.P$1(GND) U11.1(GND/ADJ) U11.4(GND) XTAL1.1(OE) XTAL1.2(GND)
LED1+ [LED]: CR1.A R7.1
LED1+1 [LED]: CR3.A R5.1
LED1+2 [LED]: CR4.A R47.1
LED1- [LED]: CR1.C Q1.3(D)
LED2+ [LED]: CR2.A R8.1
LV_CLK_CPU_R [Signal]: R4.1 U8.5(Y1)
NC@1 [Signal]: U1.B7(NC)
NC@2 [Signal]: U1.B9(NC)
NC@3 [Signal]: U1.B11(NC)
NC@4 [Signal]: U1.B13(NC)
NC@5 [Signal]: U1.D6(NC)
PSTAT0 [Signal]: J3.6 U1.A16(PSTAT0) U9.3(B:Y4)
PSTAT1 [Signal]: J3.7 U1.B15(PSTAT1) U9.5(B:Y3)
PSTAT2 [Signal]: J3.8 U1.A15(PSTAT2) U9.7(B:Y2)
R11+ [LED]: Q2.3(D) R8.2
R/!W [Signal]: J7.16 U1.E2(R/!W)
R_PSTAT0 [Signal]: R1.1 S2.1A(COM1) U9.17(B:A4)
R_PSTAT1 [Signal]: R2.1 S2.2A(COM2) U9.15(B:A3)
R_PSTAT2 [Signal]: R3.1 S2.3A(COM3) U9.13(B:A2)
RES1 [Signal]: U1.A14(RES1)
RES2 [Signal]: U1.B14(RES2)
RSVD [Signal]: R33.1 U1.D5(RSVD)
TC0 [Signal]: J7.12 R32.1 U1.F4(TC0)
TC1 [Signal]: J7.5 R31.1 U1.A2(TC1)
TC2 [Signal]: J7.9 R30.1 U1.B2(TC2)
TC3 [Signal]: J7.7 R29.1 U1.B3(TC3)
TCK [Signal]: J2.9 U1.A12(TCK)
TDI [Signal]: J2.5 U1.A13(TDI)
TDO [Signal]: J2.13 U1.A9(TDO)
TMS [Signal]: J2.7 U1.A11(TMS)
TSIZ0 [Signal]: J7.15 R28.1 U1.B1(TSIZ0)
TSIZ1 [Signal]: J7.6 R27.1 U1.C2(TSIZ1)
Unconnected: J2.2 J2.17 J2.19 J3.1 J3.2 J3.3 J3.4 J3.5 J3.9 J3.10 J3.11 J3.12 J3.13 J3.14 J3.16 J4.1 J4.2 J4.3 J4.4 J5.1 J5.2 J5.3 J5.4 J6.1 J6.2 J6.3 J6.4 J7.1 J7.2 J7.3 J7.4 U8.6(Y2) U8.7(Y3) U8.8(Y4) U9.1(A:G) U9.2(A:A1) U9.4(A:A2) U9.6(A:A3) U9.8(A:A4) U9.9(B:Y1) U9.11(B:A1) U9.12(A:Y4) U9.14(A:Y3) U9.16(A:Y2) U9.18(A:Y1)

## Buses
BP[0..7],D[0..63]

## Notes on the sheet
- DNC | DNC | DNC | DNC
- DNC | DNC | DNC | DNC
- DNC
- DNC
- DNC
- CLK
- DNC | DNC
- DNC | DNC | DNC | DNC
- DNC | DNC
- (Removed)
- (NOP) 1111 0100    0000 0000     0101 1000    0000 0000 | (NOP) 1111 0100    0000 0000     0101 1000    0000 0000

## Library data of the parts
C1-C66 C73-C76 = Capacitor:C-US: Capacitor - ANSI; CATEGORY: Capacitor; LCSC_PART: C14663; PACKAGE_SIZE: 0603; PACKAGE_TYPE: SMD; SUBCATEGORY: Ceramic Capacitors; TYPE: MLCC
C67 C69 = Capacitor:C-US: Capacitor - ANSI; CATEGORY: Capacitor; LCSC_PART: C86295; PACKAGE_SIZE: 0603; PACKAGE_TYPE: SMD; SUBCATEGORY: Ceramic Capacitors; TYPE: MLCC
C68 = Capacitor:C-POL-US: Capacitor Polarised - ANSI; CATEGORY: Capacitor; LCSC_PART: C129696; PACKAGE_SIZE: 2917; PACKAGE_TYPE: SMD; SUBCATEGORY: Tantalum Capacitors; TYPE: Polymer Capacitors
C70 = Capacitor:C-US: Capacitor - ANSI; CATEGORY: Capacitor; LCSC_PART: C1955164; PACKAGE_SIZE: 0603; PACKAGE_TYPE: SMD; SUBCATEGORY: Ceramic Capacitors; TYPE: MLCC
CR1 CR3 CR4 = led:LED: LED OSRAM: - CHIPLED LG R971, LG N971, LY N971, LG Q971, LY Q971, LO R971, LY R971 LH N974, LH R974 LS Q976, LO Q976, LY Q976 LO Q996 - Hyper CHIPLED LW Q18S LB Q993, LB Q99A, LB R99A - SideLED LS A670, LO A670, LY A670, LG A670, LP A670 LB A673, LV A673, LT A673, LW A673 LH A674 LY A675 LS A676, LA A676, LO A676, LY A676, LW A676 LS A679, LY A679, LG A679 - Hyper Micro SIDELED® LS Y876, LA Y876, LO Y876, LY Y876 LT Y87S - SmartLED LW L88C, LW L88S LB L89C, LB L89S, LG L890 LS L89K, LO L89K, LY L89K LS L896, LA L896, LO L896, LY L896 - TOPLED LS T670, LO T670, LY T670, LG T670, LP T670 LSG T670, LSP T670, LSY T670, LOP T670, LYG T670 LG T671, LOG T671, LSG T671 LB T673, LV T673, LT T673, LW T673 LH T674 LS T676, LA T676, LO T676, LY T676, LB T676, LH T676, LSB T676, LW T676 LB T67C, LV T67C, LT T67C, LS T67K, LO T67K, LY T67K, LW E67C LS E67B, LA E67B, LO E67B, LY E67B, LB E67C, LV E67C, LT E67C LW T67C LS T679, LY T679, LG T679 LS T770, LO T770, LY T770, LG T770, LP T770 LB T773, LV T773, LT T773, LW T773 LH T774 LS E675, LA E675, LY E675, LS T675 LS T776, LA T776, LO T776, LY T776, LB T776 LHGB T686 LT T68C, LB T68C - Hyper Mini TOPLED® LB M676 - Mini TOPLED Santana® LG M470 LS M47K, LO M47K, LY M47K Source: http://www.osram.convergy.de LUXEON: - LUMILED® LXK2-PW12-R00, LXK2-PW12-S00, LXK2-PW14-U00, LXK2-PW14-V00 LXK2-PM12-R00, LXK2-PM12-S00, LXK2-PM14-U00 LXK2-PE12-Q00, LXK2-PE12-R00, LXK2-PE12-S00, LXK2-PE14-T00, LXK2-PE14-U00 LXK2-PB12-K00, LXK2-PB12-L00, LXK2-PB12-M00, LXK2-PB14-N00, LXK2-PB14-P00, LXK2-PB14-Q00 LXK2-PR12-L00, LXK2-PR12-M00, LXK2-PR14-Q00, LXK2-PR14-R00 LXK2-PD12-Q00, LXK2-PD12-R00, LXK2-PD12-S00 LXK2-PH12-R00, LXK2-PH12-S00 LXK2-PL12-P00, LXK2-PL12-Q00, LXK2-PL12-R00 Source: www.luxeon.com KINGBRIGHT: KA-3528ASYC Source: www.kingbright.com; LCSC_PART: C12624
CR2 = led:LED: LED OSRAM: - CHIPLED LG R971, LG N971, LY N971, LG Q971, LY Q971, LO R971, LY R971 LH N974, LH R974 LS Q976, LO Q976, LY Q976 LO Q996 - Hyper CHIPLED LW Q18S LB Q993, LB Q99A, LB R99A - SideLED LS A670, LO A670, LY A670, LG A670, LP A670 LB A673, LV A673, LT A673, LW A673 LH A674 LY A675 LS A676, LA A676, LO A676, LY A676, LW A676 LS A679, LY A679, LG A679 - Hyper Micro SIDELED® LS Y876, LA Y876, LO Y876, LY Y876 LT Y87S - SmartLED LW L88C, LW L88S LB L89C, LB L89S, LG L890 LS L89K, LO L89K, LY L89K LS L896, LA L896, LO L896, LY L896 - TOPLED LS T670, LO T670, LY T670, LG T670, LP T670 LSG T670, LSP T670, LSY T670, LOP T670, LYG T670 LG T671, LOG T671, LSG T671 LB T673, LV T673, LT T673, LW T673 LH T674 LS T676, LA T676, LO T676, LY T676, LB T676, LH T676, LSB T676, LW T676 LB T67C, LV T67C, LT T67C, LS T67K, LO T67K, LY T67K, LW E67C LS E67B, LA E67B, LO E67B, LY E67B, LB E67C, LV E67C, LT E67C LW T67C LS T679, LY T679, LG T679 LS T770, LO T770, LY T770, LG T770, LP T770 LB T773, LV T773, LT T773, LW T773 LH T774 LS E675, LA E675, LY E675, LS T675 LS T776, LA T776, LO T776, LY T776, LB T776 LHGB T686 LT T68C, LB T68C - Hyper Mini TOPLED® LB M676 - Mini TOPLED Santana® LG M470 LS M47K, LO M47K, LY M47K Source: http://www.osram.convergy.de LUXEON: - LUMILED® LXK2-PW12-R00, LXK2-PW12-S00, LXK2-PW14-U00, LXK2-PW14-V00 LXK2-PM12-R00, LXK2-PM12-S00, LXK2-PM14-U00 LXK2-PE12-Q00, LXK2-PE12-R00, LXK2-PE12-S00, LXK2-PE14-T00, LXK2-PE14-U00 LXK2-PB12-K00, LXK2-PB12-L00, LXK2-PB12-M00, LXK2-PB14-N00, LXK2-PB14-P00, LXK2-PB14-Q00 LXK2-PR12-L00, LXK2-PR12-M00, LXK2-PR14-Q00, LXK2-PR14-R00 LXK2-PD12-Q00, LXK2-PD12-R00, LXK2-PD12-S00 LXK2-PH12-R00, LXK2-PH12-S00 LXK2-PL12-P00, LXK2-PL12-Q00, LXK2-PL12-R00 Source: www.luxeon.com KINGBRIGHT: KA-3528ASYC Source: www.kingbright.com; LCSC_PART: C2286
J1 = JACK-C-PC-10A-RA_R_:JACK-C-PC-10A-RA(R): PC MOUNTABLE JACK FOR 5.5X2.1MM; MANUFACTURER: Globe Tek; PARTREV: A; STANDARD: Manufacturer Recommendations
J2 J3 = 30320-6002:30320-6002HB; COPYRIGHT: Copyright (C) 2024 Ultra Librarian. All rights reserved.; LCSC_PART: C5157633; MANUFACTURER_PART_NUMBER: 30320-6002HB; MFR_NAME: 3M
J4-J7 = 2-767004-2:2-767004-2: CONN RECEPT 38POS .025 VERT SMD; LCSC_PART: C2931194; MANUFACTURER: TE CONNECTIVITY; METADATA: Manufacturer recommendation; PARTREV: AC1
Q1 = Transistor:NMOSFET: N-Channel MOSFET - Generic; CATEGORY: Transistor; LCSC_PART: C20917; SUB-CATEGORY: MOSFET; TYPE: N-Channel
Q2 = Transistor:PMOSFET: P-Channel MOSFET - Generic; CATEGORY: Transistor; LCSC_PART: C15127; SUB-CATEGORY: MOSFET; TYPE: P-Channel
R1-R3 R34-R44 = Resistor:R-US: Resistor Fixed - ANSI; CATEGORY: Resistors; DESCRIPTION: Chip Resistor 1.60 X 0.82 X 0.60 mm body 0603(1608-METRIC) Package; LCSC_PART: C21190; PACKAGE_SIZE: 0603; PACKAGE_TYPE: SMD
R4 = Resistor:R-US: Resistor Fixed - ANSI; CATEGORY: Resistors; DESCRIPTION: Chip Resistor 1.60 X 0.82 X 0.60 mm body 0603(1608-METRIC) Package; LCSC_PART: C21189; PACKAGE_SIZE: 0603; PACKAGE_TYPE: SMD
R5 R7 = Resistor:R-US: Resistor Fixed - ANSI; CATEGORY: Resistors; DESCRIPTION: Chip Resistor 1.60 X 0.82 X 0.60 mm body 0603(1608-METRIC) Package; LCSC_PART: C22962; PACKAGE_SIZE: 0603; PACKAGE_TYPE: SMD
R6 R9-R15 R18-R25 R33 = Resistor:R-US: Resistor Fixed - ANSI; CATEGORY: Resistors; DESCRIPTION: Chip Resistor 1.60 X 0.82 X 0.60 mm body 0603(1608-METRIC) Package; LCSC_PART: C25804; PACKAGE_SIZE: 0603; PACKAGE_TYPE: SMD
R8 = Resistor:R-US: Resistor Fixed - ANSI; CATEGORY: Resistors; DESCRIPTION: Chip Resistor 1.60 X 0.82 X 0.60 mm body 0603(1608-METRIC) Package; LCSC_PART: C23138; PACKAGE_SIZE: 0603; PACKAGE_TYPE: SMD
R16 R17 R26-R32 R45 R46 R51-R114 = Resistor:R-US: Resistor Fixed - ANSI; CATEGORY: Resistors; DESCRIPTION: Chip Resistor 1.60 X 0.82 X 0.60 mm body 0603(1608-METRIC) Package; LCSC_PART: C23162; PACKAGE_SIZE: 0603; PACKAGE_TYPE: SMD
R47 = Resistor:R-US: Resistor Fixed - ANSI; CATEGORY: Resistors; DESCRIPTION: Chip Resistor 1.60 X 0.82 X 0.60 mm body 0603(1608-METRIC) Package; LCSC_PART: C23182; PACKAGE_SIZE: 0603; PACKAGE_TYPE: SMD
S1 = TS-1187A-B-A-B:TS-1187A-B-A-B: SPST 50mA @ 12VDC Top Actuated Round Button 160gf SMD Tactile Switches RoHS Check availability <https://pricing.snapeda.com/parts/TS-1187A-B-A-B/XKB%20Industrial%20Precision/view-part?ref=eda>; AVAILABILITY: Not in stock; CHECK_PRICES: https://www.snapeda.com/parts/TS-1187A-B-A-B/XKB+Industrial+Precision/view-part/?ref=eda; DESCRIPTION: TS-1187A-B-A-B XKB Connectivity; LCSC_PART: C318884; MF: XKB Industrial Precision; MP: TS-1187A-B-A-B; PACKAGE: Package; PRICE: None; SNAPEDA_LINK: https://www.snapeda.com/parts/TS-1187A-B-A-B/XKB+Industrial+Precision/view-part/?ref=snap
S2 = DS04-254-1-03BK-SMT:DS04-254-1-03BK-SMT; LCSC_PART: C129079; MANUFACTURER: CUI Inc.; MAXIMUM_PACKAGE_HEIGHT: 4.86 mm; PARTREV: V0.0; STANDARD: Manufacturer Recommendations
TP1 = testpad:TP: Test pad
U1 = MC88110:MC88110RC50H: Motorola MC88110 PGA299 Package; LCSC_PART: C7187107
U8 = 74AVC9112DCH:74AVC9112DCH: 74AVC9112 - 1-to-4 fan-out buffer@en-us Source: Datasheet <https://assets.nexperia.com/documents/data-sheet/74AVC9112.pdf>; DESCRIPTION: 74AVC9112 - 1-to-4 fan-out buffer@en-us; HEIGHT: 1mm; LCSC_PART: C546283; MANUFACTURER_NAME: Nexperia; MANUFACTURER_PART_NUMBER: 74AVC9112DCH; MOUSER_PART_NUMBER: 771-74AVC9112DCH; MOUSER_PRICE-STOCK: https://www.mouser.co.uk/ProductDetail/Nexperia/74AVC9112DCH?qs=MLItCLRbWszsM94Jl1aMAA%3D%3D
U9 = 74HCT244PW:74HCT244; LCSC_PART: C131088
U10 = R3132Q:R3132Q; LCSC_PART: C2461150
U11 = AMS1117-3.3:AMS1117-3.3: Check availability <https://pricing.snapeda.com/parts/AMS1117-3.3/Advanced%20Monolithic%20Systems/view-part?ref=eda>; AVAILABILITY: Not in stock; CHECK_PRICES: https://www.snapeda.com/parts/AMS1117-3.3/Advanced+Monolithic+Systems/view-part/?ref=eda; DESCRIPTION: Sot223/Pkg 1-Amp 3.3-Volt Low Drop Out Voltage Regulatator; LCSC_PART: C6186; MF: Advanced Monolithic Systems; MP: AMS1117-3.3; PACKAGE: SOT-223 Seeed Technology; PRICE: None; SNAPEDA_LINK: https://www.snapeda.com/parts/AMS1117-3.3/Advanced+Monolithic+Systems/view-part/?ref=snap
XTAL1 = Frequency-Source:OSC: Oscillator - Generic; CATEGORY: Crystals; LCSC_PART: C5203552; PACKAGE_SIZE: 4-SMD No Lead; PACKAGE_TYPE: SMD